# EAGLE design watch (EAGLE 7.5.0)
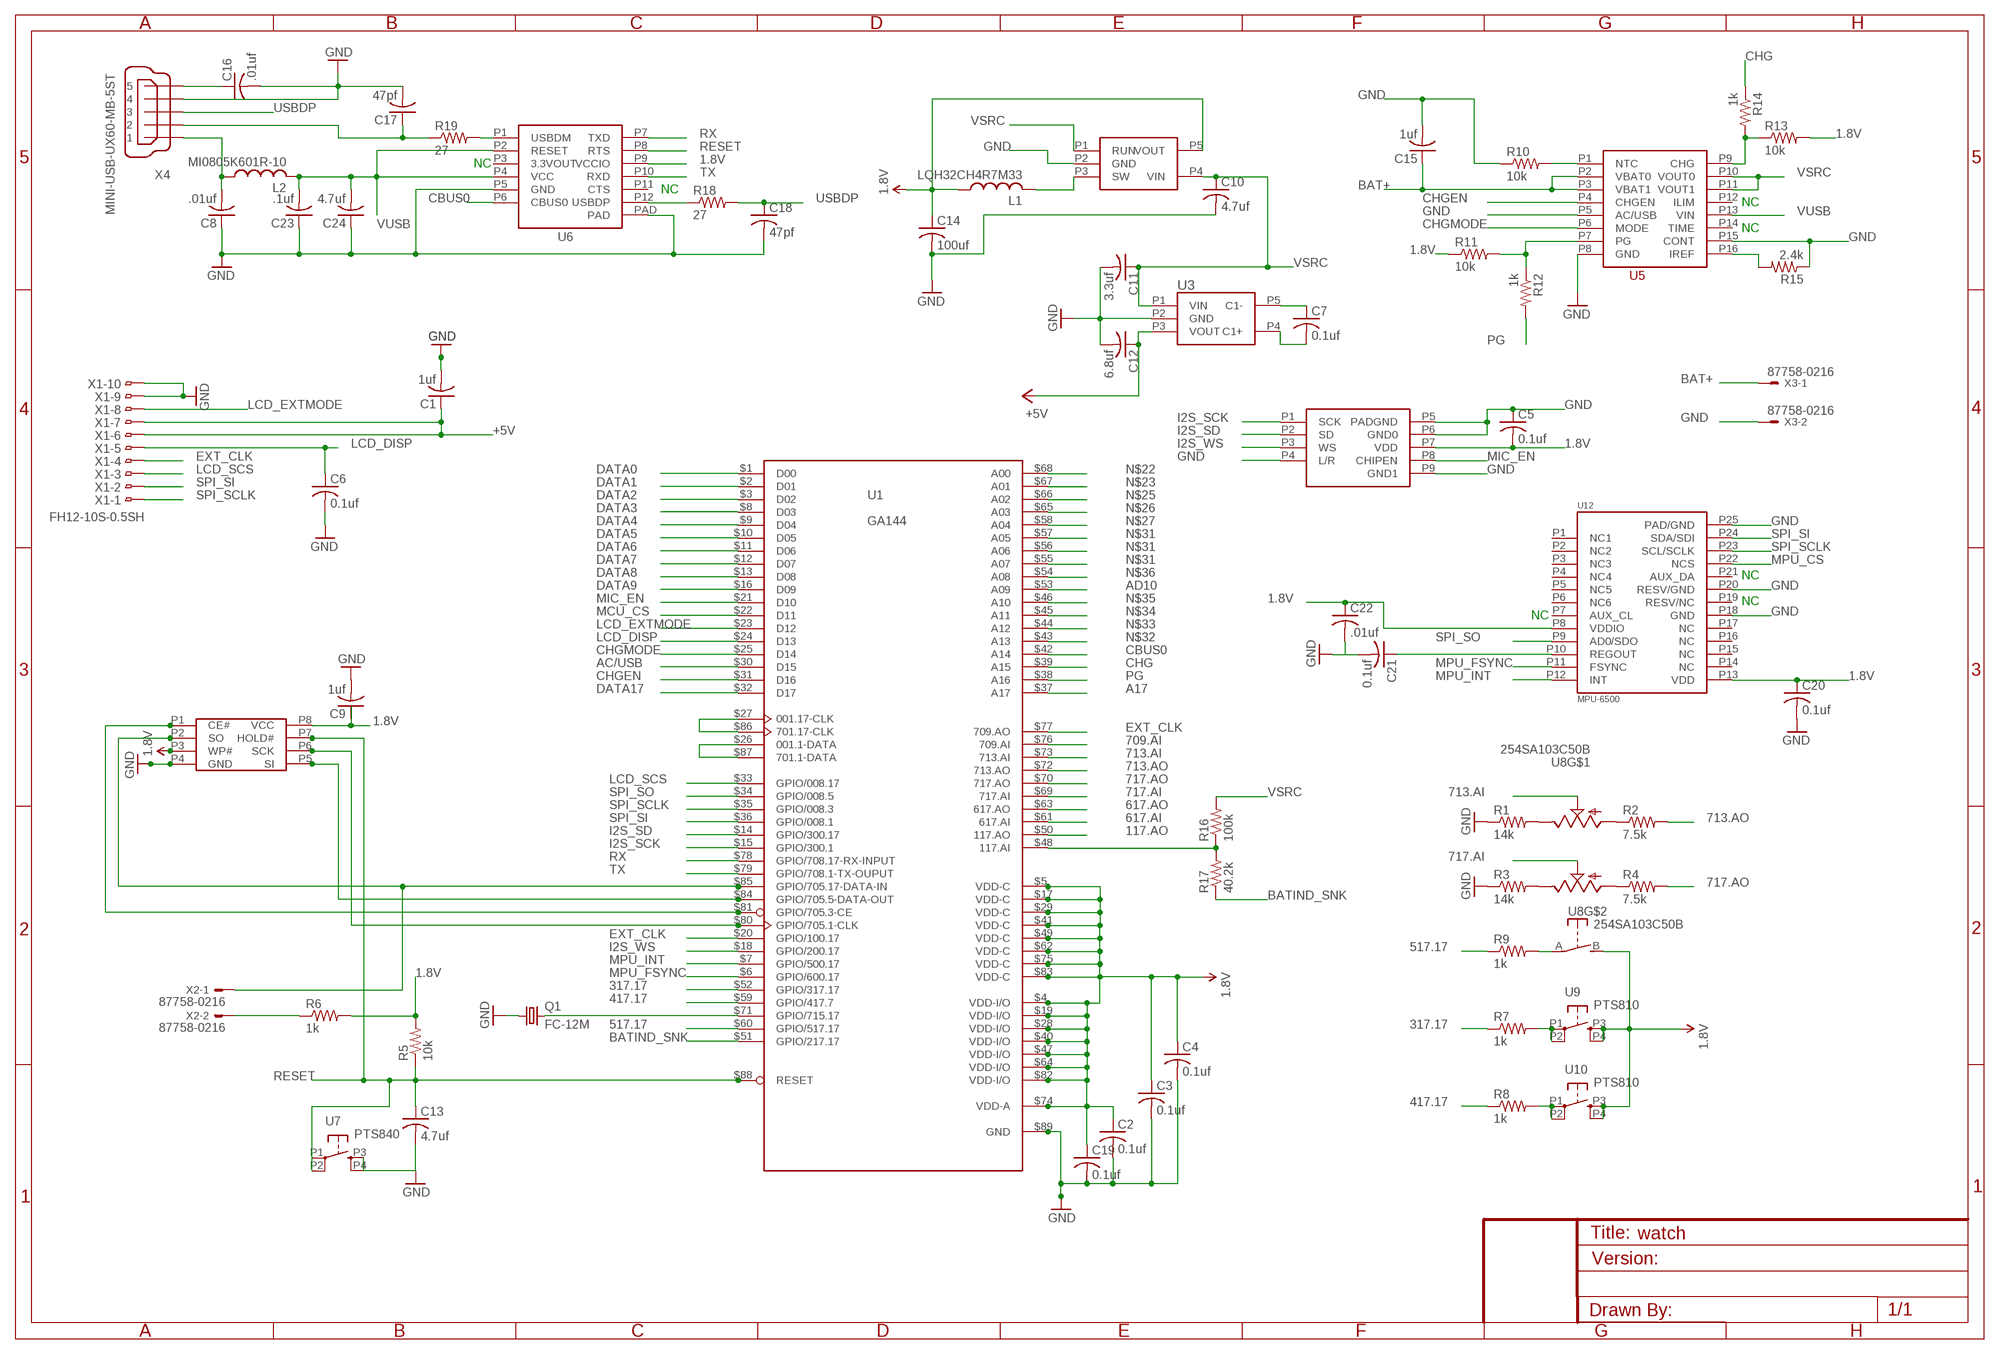
[diagram p0: schematic, sheet 1]

## Parts
C1  1uf  C-USC0402  [C0402]
C2  0.1uf  C-USC0402  [C0402]
C3  0.1uf  C-USC0402  [C0402]
C4  0.1uf  C-USC0402  [C0402]
C5  0.1uf  C-USC0402  [C0402]
C6  0.1uf  C-USC0402  [C0402]
C7  0.1uf  C-USC0402  [C0402]
C8  .01uf  C-USC0402  [C0402]
C9  1uf  C-USC0402  [C0402]
C10  4.7uf  C-USC0603  [C0603]
C11  3.3uf  C-USC0603  [C0603]
C12  6.8uf  C-USC0805  [C0805]
C13  4.7uf  C-USC0603  [C0603]
C14  100uf  C-USC1206  [C1206]
C15  1uf  C-USC0402  [C0402]
C16  .01uf  C-USC0402  [C0402]
C17  47pf  C-USC0402  [C0402]
C18  47pf  C-USC0402  [C0402]
C19  0.1uf  C-USC0402  [C0402]
C20  0.1uf  C-USC0402  [C0402]
C21  0.1uf  C-USC0402  [C0402]
C22  .01uf  C-USC0402  [C0402]
C23  .1uf  C-USC0402  [C0402]
C24  4.7uf  C-USC0402  [C0402]
L1  LQH32CH4R7M33  [1210]
L2  MI0805K601R-10  [C0805]
Q1  FC-12M  [FC-12M]
R1  14k  R-US_R0402  [R0402]
R2  7.5k  R-US_R0402  [R0402]
R3  14k  R-US_R0402  [R0402]
R4  7.5k  R-US_R0402  [R0402]
R5  10k  R-US_R0402  [R0402]
R6  1k  R-US_R0402  [R0402]
R7  1k  R-US_R0402  [R0402]
R8  1k  R-US_R0402  [R0402]
R9  1k  R-US_R0402  [R0402]
R10  10k  R-US_R0402  [R0402]
R11  10k  R-US_R0402  [R0402]
R12  1k  R-US_R0402  [R0402]
R13  10k  R-US_R0402  [R0402]
R14  1k  R-US_R0402  [R0402]
R15  2.4k  R-US_R0402  [R0402]
R16  100k  R-US_R0402  [R0402]
R17  40.2k  R-US_R0402  [R0402]
R18  27  R-US_R0402  [R0402]
R19  27  R-US_R0402  [R0402]
U1  GA144  [QFN88-0.4MM]
U2  LTC3406-1.8  [TSOT23]
U3  LTC1517-5  [TSOT23]
U4  IS25WP128-JKLE  [WSON8]
U5  ISL9230  [16_LD_QFN]
U6  FT234XD  [DFN-12]
U7  PTS840  [PTS840GMPSMTRLFS]
U8  254SA103C50B  [254SA103C50B]
U9  PTS810  [PTS810]
U10  PTS810  [PTS810]
U11  INMP441  [INMP441]
U12  MPU-6500  [QFN24-3]
X1  FH12-10S-0.5SH  [FH12-10S-0.5SH]
X2  87758-0216  [87758-0216]
X3  87758-0216  [87758-0216]
X4  MINI-USB-UX60-MB-5ST  [UX60-MB-5ST]

## Nets
1.8V: C2.1 C3.1 C4.1 C5.2 C9.1 C14.1 C19.1 C20.1 C22.1 L1.P$1 R5.2 R6.2 R11.1 R13.2 U1.$4(VDD-I/O) U1.$5(VDD-C) U1.$17(VDD-C) U1.$19(VDD-I/O) U1.$28(VDD-I/O) U1.$29(VDD-C) U1.$40(VDD-I/O) U1.$41(VDD-C) U1.$47(VDD-I/O) U1.$49(VDD-C) U1.$62(VDD-C) U1.$64(VDD-I/O) U1.$74(VDD-A) U1.$75(VDD-C) U1.$82(VDD-I/O) U1.$83(VDD-C) U2.P5(VOUT) U4.P3(WP#) U4.P8(VCC) U6.P9(VCCIO) U8.B U9.P3(S) U9.P4(S1) U10.P3(S) U10.P4(S1) U11.P7(VDD) U12.P8(VDDIO) U12.P13(VDD)
117.AO: U1.$50(117.AO)
317.17: R7.1 U1.$52(GPIO/317.17)
417.17: R8.1 U1.$59(GPIO/417.7)
517.17: R9.1 U1.$60(GPIO/517.17)
617.AI: U1.$61(617.AI)
617.AO: U1.$63(617.AO)
709.AI: U1.$76(709.AI)
713.AI: U1.$73(713.AI) U8.P2
713.AO: R2.2 U1.$72(713.AO)
717.AI: U1.$69(717.AI) U8.P2'
717.AO: R4.2 U1.$70(717.AO)
+5V: C1.1 C12.1 U3.P3(VOUT) X1.6 X1.7
A17: U1.$37(A17)
AC/USB: U1.$30(D15)
AD10: U1.$53(A09)
BAT+: C15.1 U5.P2(VBAT0) U5.P3(VBAT1) X3.1
BATIND: R16.1 R17.2 U1.$48(117.AI)
BATIND_SNK: R17.1 U1.$51(GPIO/217.17)
CBUS0: U1.$42(A14) U6.P6(CBUS0)
CHG: R14.1 U1.$39(A15)
CHGEN: U1.$31(D16) U5.P4(CHGEN)
CHGMODE: U1.$25(D14) U5.P6(MODE)
DATA0: U1.$1(D00)
DATA1: U1.$2(D01)
DATA2: U1.$3(D02)
DATA3: U1.$8(D03)
DATA4: U1.$9(D04)
DATA5: U1.$10(D05)
DATA6: U1.$11(D06)
DATA7: U1.$12(D07)
DATA8: U1.$13(D08)
DATA9: U1.$16(D09)
DATA17: U1.$32(D17)
EXT_CLK: U1.$20(GPIO/100.17) U1.$77(709.AO) X1.4
GND: C1.2 C2.2 C3.2 C4.2 C5.1 C6.2 C8.1 C9.2 C10.2 C11.2 C12.2 C13.2 C14.2 C15.2 C16.2 C17.2 C18.2 C19.2 C20.2 C21.2 C22.2 C23.1 C24.1 Q1.1 R1.1 R3.1 R10.1 R15.1 U1.$89(GND) U2.P2(GND) U3.P2(GND) U4.P4(GND) U5.P5(AC/USB) U5.P8(GND) U5.P15(CONT) U6.P5(GND) U6.PAD U7.P3(S) U7.P4(S1) U11.P4(L/R) U11.P5(PADGND) U11.P6(GND0) U11.P9(GND1) U12.P18(GND) U12.P20(RESV/GND) U12.P25(PAD/GND) X1.9 X1.10 X3.2 X4.4
I2S_SCK: U1.$15(GPIO/300.1) U11.P1(SCK)
I2S_SD: U1.$14(GPIO/300.17) U11.P2(SD)
I2S_WS: U1.$18(GPIO/200.17) U11.P3(WS)
LCD_DISP: C6.1 U1.$24(D13) X1.5
LCD_EXTMODE: U1.$23(D12) X1.8
LCD_SCS: U1.$33(GPIO/008.17) X1.3
MCU_CS: U1.$22(D11)
MIC_EN: U1.$21(D10) U11.P8(CHIPEN)
MPU_CS: U12.P22(NCS)
MPU_FSYNC: U1.$6(GPIO/600.17) U12.P11(FSYNC)
MPU_INT: U1.$7(GPIO/500.17) U12.P12(INT)
N$1: R6.1 X2.2
N$2: C7.1 U3.P5(C1-)
N$3: C7.2 U3.P4(C1+)
N$4: R10.2 U5.P1(NTC)
N$5: U1.$26(001.1-DATA) U1.$87(701.1-DATA)
N$6: U1.$27(001.17-CLK) U1.$86(701.17-CLK)
N$7: L1.P$2 U2.P3(SW)
N$8: Q1.2 U1.$71(GPIO/715.17)
N$9: U1.$81(GPIO/705.3-CE) U4.P1(CE#)
N$10: U1.$85(GPIO/705.17-DATA-IN) U4.P2(SO) X2.1
N$12: R15.2 U5.P16(IREF)
N$13: C21.1 U12.P10(REGOUT)
N$14: R11.2 R12.1 U5.P7(PG)
N$15: R1.2 U8.P1
N$16: R2.1 U8.P3
N$17: R3.2 U8.P1'
N$18: R4.1 U8.P3'
N$19: R7.2 U9.P1(P) U9.P2(P1)
N$20: R8.2 U10.P1(P) U10.P2(P1)
N$21: R13.1 R14.2 U5.P9(CHG)
N$22: U1.$68(A00)
N$23: U1.$67(A01)
N$24: R9.2 U8.A
N$25: U1.$66(A02)
N$26: U1.$65(A03)
N$27: U1.$58(A04)
N$28: C16.1 X4.5
N$29: U1.$57(A05)
N$30: U1.$56(A06)
N$31: U1.$55(A07)
N$32: U1.$43(A13)
N$33: U1.$44(A12)
N$34: U1.$45(A11)
N$35: U1.$46(A10)
N$36: U1.$54(A08)
N$45: U1.$84(GPIO/705.5-DATA-OUT) U4.P5(SI)
PG: R12.2 U1.$38(A16)
RESET: C13.1 R5.1 U1.$88(RESET) U4.P7(HOLD#) U6.P8(RTS) U7.P1(P) U7.P2(P1)
RX: U1.$78(GPIO/708.17-RX-INPUT) U6.P7(TXD)
SCK: U1.$80(GPIO/705.1-CLK) U4.P6(SCK)
SPI_SCLK: U1.$35(GPIO/008.3) U12.P23(SCL/SCLK) X1.1
SPI_SI: U1.$36(GPIO/008.1) U12.P24(SDA/SDI) X1.2
SPI_SO: U1.$34(GPIO/008.5) U12.P9(AD0/SDO)
TX: U1.$79(GPIO/708.1-TX-OUPUT) U6.P10(RXD)
USBDM: C17.1 R19.1 R19.2 U6.P1(USBDM) X4.2
USBDP: C18.1 R18.1 R18.2 U6.P12(USBDP) X4.3
VSRC: C10.1 C11.1 R16.2 U2.P1(RUN) U2.P4(VIN) U3.P1(VIN) U5.P10(VOUT0) U5.P11(VOUT1)
VUSB: C8.2 C23.2 C24.2 L2.1 L2.2 U5.P13(VIN) U6.P2(RESET) U6.P4(VCC) X4.1
Unconnected: U5.P12(ILIM) U5.P14(TIME) U6.P3(3.3VOUT) U6.P11(CTS) U12.P1(NC1) U12.P2(NC2) U12.P3(NC3) U12.P4(NC4) U12.P5(NC5) U12.P6(NC6) U12.P14(NC) U12.P15(NC) U12.P16(NC) U12.P17(NC)

## Notes on the sheet
- NC
- NC
- NC
- NC
- NC
- NC
- NC

## Power pins joined to a net without a drawn wire
AUX_CL: U12.P7(AUX_CL)
AUX_DA: U12.P21(AUX_DA)
RESV/NC: U12.P19(RESV/NC)

## Library data of the parts
C1-C13 C15-C24 = resistor:C-US: CAPACITOR, American symbol
C14 = ga144:C-US: CAPACITOR, American symbol
L1 = ga144:LQH32CH4R7M33
L2 = ga144:MI0805K601R-10: FERRITE CHIP POWER 600 OHM SMD
Q1 = crystal:FC-12M: kHz RANGE CRYSTAL UNIT LOW PROFILE SMD Source: Epson Toyocom FC-12M.pdf
R1-R19 = resistor:R-US_: RESISTOR, American symbol
U1 = ga144:GA144: Parallel Processing for Embedded Systems The GA144 measures just 1cm x 1cm. It integrates 144 F18A computers in an 18 x 8 array. # Each of its F18A computers can perform a basic ALU function in about 1.5 nanoseconds while only consuming about 7 picojoules. http://greenarraychips.com/ library GA144 eagle : http://esaid.free.fr/
U2 = ga144:LTC3406-1.8
U3 = ga144:LTC1517-5
U4 = ga144:IS25WP128-JKLE: The IS25WP128/064/032 Serial Flash memory offers a versatile storage solution with high flexibility and performance in a simplified pin count package. ISSI’s “Industry Standard Serial Interface” Flash is for systems that require limited space, a low pin count, and low power consumption. The device is accessed through a 4-wire SPI Interface consisting of a Serial Data Input (SI), Serial Data Output (SO), Serial Clock (SCK), and Chip Enable (CE#) pins, which can also be configured to serve as multi-I/O (see pin descriptions).
U5 = ga144:ISL9230
U6 = ga144:FT234XD
U7 = ga144:PTS840: PTS840GMPSMTRLFS
U8 = ga144:254SA103C50B
U9 U10 = ga144:PTS810: PTS840GMPSMTRLFS
U11 = ga144:INMP441
U12 = MPU-60X0:MPU-6500: MPU-6500
X1 = con-hirose:FH12-10S-0.5S: 0.5mm Pitch Connectors For FPC/FFC Source: Data sheet <http://www.hirose.co.jp/cataloge_hp/e58605370.pdf>; MPN: FH12-10S-0.5SH(55); OC_FARNELL: 1324540; OC_NEWARK: 34M6152
X2 X3 = con-molex:87758-0216: 2 Pin - 2mm Dual Row Single Wafer, Vertical T/H HDR Source: http://www.molex.com/pdm_docs/sd/877580616_sd.pdf; MPN: 87758-0216; OC_FARNELL: unknown; OC_NEWARK: 94M1513
X4 = con-hirose:MINI-USB-: MINI USB Connector Source: http://www.hirose.co.jp/cataloge_hp/e24000019.pdf; OC_FARNELL: unknown; OC_NEWARK: unknown

## Board
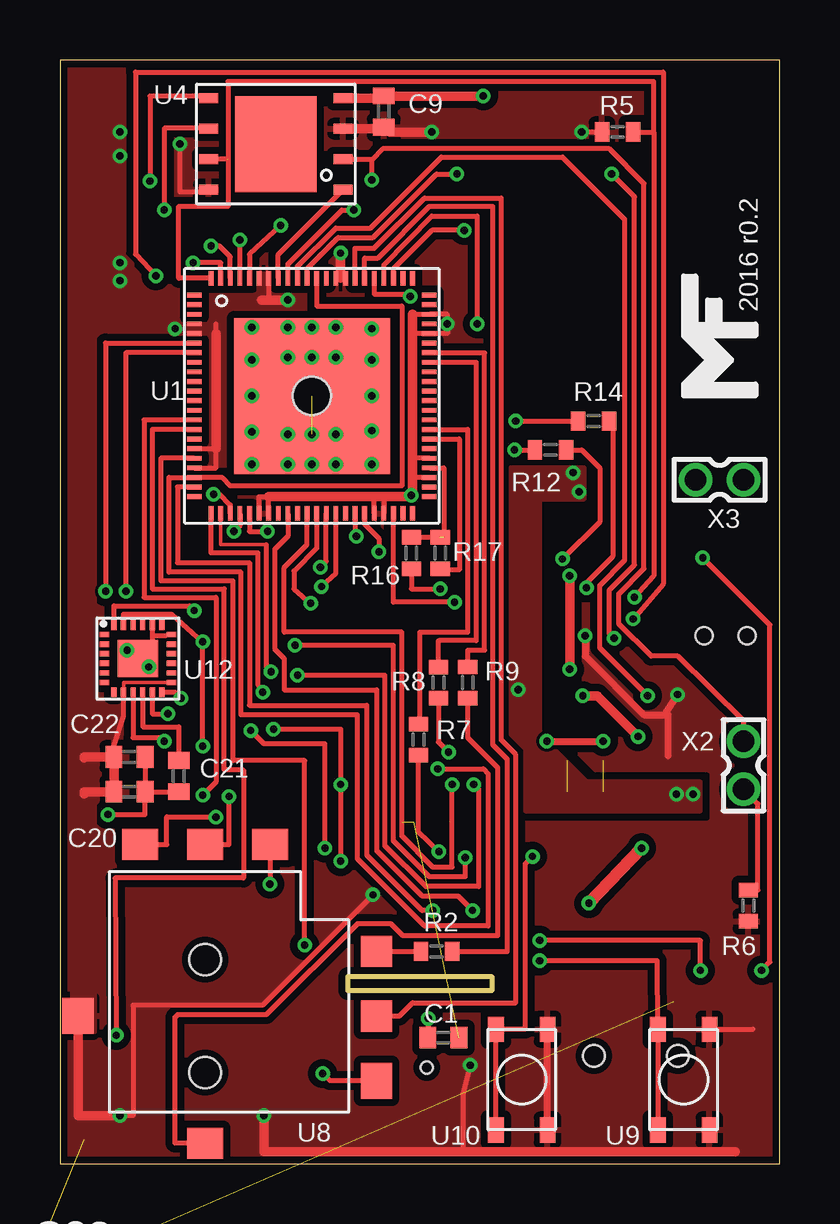
[diagram p1: board, top side]
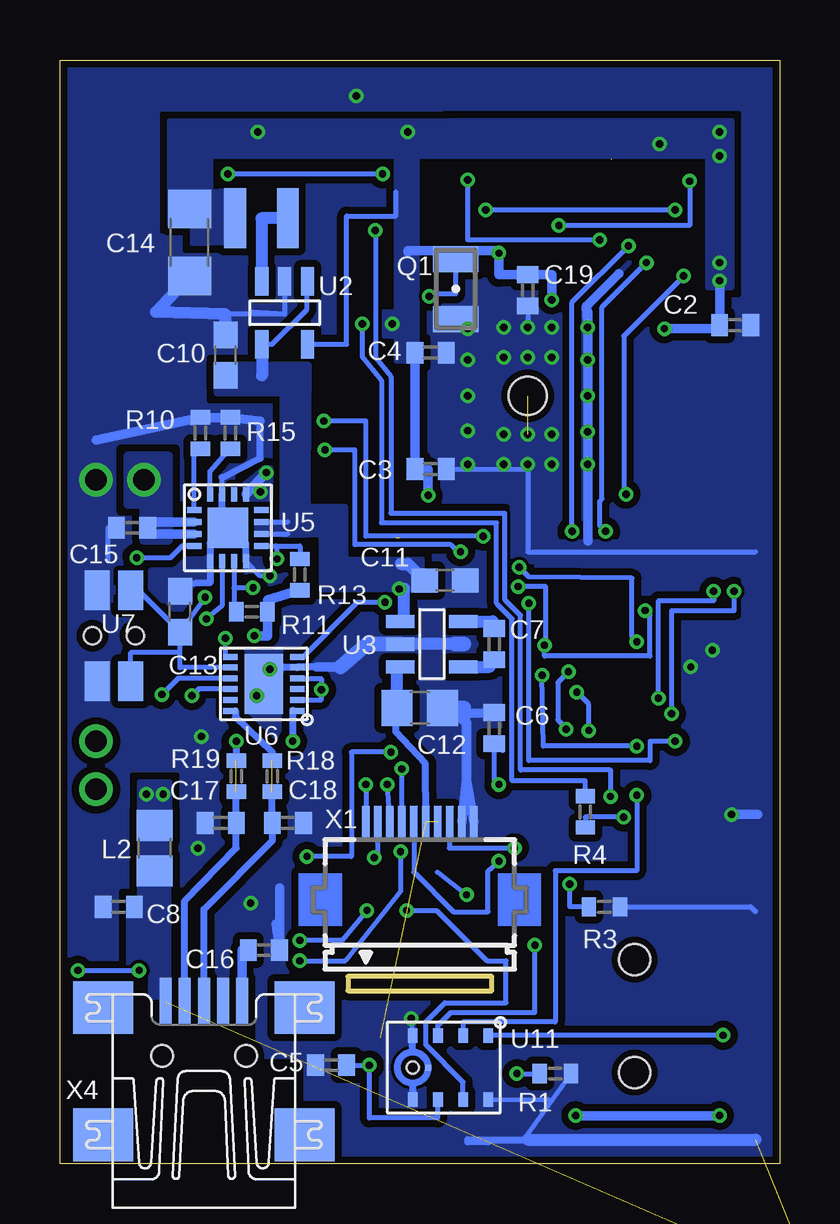
[diagram p2: board, bottom side, seen from below]

Size 30 x 46 mm. Coordinates in mm from the lower left corner, seen from the top.
Outline: 0,0 30,0 30,46 0,46 0,0
Copper layers (1*16): Top 0.035mm / dielectric 1.5mm / Bottom 0.035mm
Design rules "dirt_cheap_dirty_boards.v1": minimum track width 5mil, minimum drill 12mil, track to track 5mil, track to pad 5mil, pad to pad 5mil, via to via 5mil, smd to smd 0mil, copper to edge 10mil, drill to drill 10mil, minimum pad ring 10mil, minimum via ring 6mil, stop-mask expansion 2mil, vias tented up to drill 25mil, thermal gap 10mil
Milling: area 12,7.2 to 18,7.8

### Footprints (pad centres in the part's own frame; a part is rotated, then mirrored left to right if it is on the bottom)
C0402 = smd 0.7 x 0.9: 1 -0.65,0; 2 0.65,0
C0603 = smd 1.1 x 1: 1 -0.85,0; 2 0.85,0
C0805 = smd 1.3 x 1.5: 1 -0.95,0; 2 0.95,0
C1206 = smd 1.6 x 1.8: 1 -1.4,0; 2 1.4,0
1210 = smd 0.9 x 2.5: P$1 -1.1,0; P$2 1.1,0
FC-12M = smd 1.1 x 1.9: 1 -1.25,0; 2 1.25,0
R0402 = smd 0.6 x 0.8: 1 -0.65,0; 2 0.65,0
QFN88-0.4MM = smd 0.6 x 0.2: $1 -4.9,4.2; $2 -4.9,3.8; $3 -4.9,3.4; $4 -4.9,3; $5 -4.9,2.6; $6 -4.9,2.2; $7 -4.9,1.8; $8 -4.9,1.4; $9 -4.9,1; $10 -4.9,0.6; $11 -4.9,0.2; $12 -4.9,-0.2; $13 -4.9,-0.6; $14 -4.9,-1; $15 -4.9,-1.4; $16 -4.9,-1.8; $17 -4.9,-2.2; $18 -4.9,-2.6; $19 -4.9,-3; $20 -4.9,-3.4; $21 -4.9,-3.8; $22 -4.9,-4.2; $45 4.9,-4.2; $46 4.9,-3.8; $47 4.9,-3.4; $48 4.9,-3; $49 4.9,-2.6; $50 4.9,-2.2; $51 4.9,-1.8; $52 4.9,-1.4; $53 4.9,-1; $54 4.9,-0.6; $55 4.9,-0.2; $56 4.9,0.2; $57 4.9,0.6; $58 4.9,1; $59 4.9,1.4; $60 4.9,1.8; $61 4.9,2.2; $62 4.9,2.6; $63 4.9,3; $64 4.9,3.4; $65 4.9,3.8; $66 4.9,4.2 | smd 0.2 x 0.6: $23 -4.2,-4.9; $24 -3.8,-4.9; $25 -3.4,-4.9; $26 -3,-4.9; $27 -2.6,-4.9; $28 -2.2,-4.9; $29 -1.8,-4.9; $30 -1.4,-4.9; $31 -1,-4.9; $32 -0.6,-4.9; $33 -0.2,-4.9; $34 0.2,-4.9; $35 0.6,-4.9; $36 1,-4.9; $37 1.4,-4.9; $38 1.8,-4.9; $39 2.2,-4.9; $40 2.6,-4.9; $41 3,-4.9; $42 3.4,-4.9; $43 3.8,-4.9; $44 4.2,-4.9; $67 4.2,4.9; $68 3.8,4.9; $69 3.4,4.9; $70 3,4.9; $71 2.6,4.9; $72 2.2,4.9; $73 1.8,4.9; $74 1.4,4.9; $75 1,4.9; $76 0.6,4.9; $77 0.2,4.9; $78 -0.2,4.9; $79 -0.6,4.9; $80 -1,4.9; $81 -1.4,4.9; $82 -1.8,4.9; $83 -2.2,4.9; $84 -2.6,4.9; $85 -3,4.9; $86 -3.4,4.9; $87 -3.8,4.9; $88 -4.2,4.9 | smd 6.5 x 6.5: $89 0,0 | hole 1.6: 0,0
TSOT23 = smd 0.55 x 1.2: P1 -0.95,-1.31; P2 0,-1.31; P3 0.95,-1.31; P4 0.95,1.31; P5 -0.95,1.31
WSON8 = smd 0.8 x 0.4: P1 -2.8,1.905; P2 -2.8,0.635; P3 -2.8,-0.635; P4 -2.8,-1.905; P5 2.8,-1.905; P6 2.8,-0.635; P7 2.8,0.635; P8 2.8,1.905 | smd 3.4 x 4: P$1 0,0
16_LD_QFN = smd 0.6 x 0.25: P1 -1.4,0.75; P2 -1.4,0.25; P3 -1.4,-0.25; P4 -1.4,-0.75; P9 1.4,-0.75; P10 1.4,-0.25; P11 1.4,0.25; P12 1.4,0.75 | smd 0.25 x 0.6: P5 -0.75,-1.4; P6 -0.25,-1.4; P7 0.25,-1.4; P8 0.75,-1.4; P13 0.75,1.4; P14 0.25,1.4; P15 -0.25,1.4; P16 -0.75,1.4 | smd 1.7 x 1.7: PAD 0,0
DFN-12 = smd 0.6 x 0.25: P1 -1.4,1.125; P2 -1.4,0.675; P3 -1.4,0.225; P4 -1.4,-0.225; P5 -1.4,-0.675; P6 -1.4,-1.125; P7 1.4,-1.125; P8 1.4,-0.675; P9 1.4,-0.225; P10 1.4,0.225; P11 1.4,0.675; P12 1.4,1.125 | smd 1.6 x 2.5: PAD 0,0
PTS840GMPSMTRLFS = smd 1.65 x 1.05: P1 -1.9,0.7; P2 1.9,0.7; P3 -1.9,-0.7; P4 1.9,-0.7 | hole 0.7: 0,0.9; 0,-0.9
254SA103C50B = smd 1.5 x 1.3: A 0,5.3; P1' -2.7,-7.15; P2' 0,-7.15; P3' 2.7,-7.15 | smd 1.3 x 1.5: B 5.3,0; P1 -7.15,2.7 | smd 1.3 x 1.3: P2 -7.15,0; P3 -7.15,-2.7 | hole 1.3: 0,-2.35; 0,2.35
PTS810 = smd 1.05 x 0.65: P1 -2.1,1.075; P2 2.1,1.075; P3 -2.1,-1.075; P4 2.1,-1.075
INMP441 = smd 0.4 x 0.6: P1 1.86,1.33; P2 0.81,1.33; P3 -0.24,1.33; P4 -1.29,1.33; P6 -1.29,-1.33; P7 -0.24,-1.33; P8 0.81,-1.33; P9 1.86,-1.33 | smd 0.25 x 0.25: P5 -0.65,0 | hole 0.5: -1.29,0
QFN24-3 = smd 0.4 x 0.22: P1 -1.4,1; P2 -1.4,0.6; P3 -1.4,0.2; P4 -1.4,-0.2; P5 -1.4,-0.6; P6 -1.4,-1; P13 1.4,-1; P14 1.4,-0.6; P15 1.4,-0.2; P16 1.4,0.2; P17 1.4,0.6; P18 1.4,1 | smd 0.22 x 0.4: P7 -1,-1.4; P8 -0.6,-1.4; P9 -0.2,-1.4; P10 0.2,-1.4; P11 0.6,-1.4; P12 1,-1.4; P19 1,1.4; P20 0.6,1.4; P21 0.2,1.4; P22 -0.2,1.4; P23 -0.6,1.4; P24 -1,1.4 | smd 1.7 x 1.54: P25 0,0
FH12-10S-0.5SH = smd 0.3 x 1.3: 1 -2.25,3.25; 2 -1.75,3.25; 3 -1.25,3.25; 4 -0.75,3.25; 5 -0.25,3.25; 6 0.25,3.25; 7 0.75,3.25; 8 1.25,3.25; 9 1.75,3.25; 10 2.25,3.25
87758-0216 = drill 0.9 pad 1.27: 1 0,-1; 2 0,1
UX60-MB-5ST = smd 2 x 0.5: 1 2.25,1.6; 2 2.25,0.8; 3 2.25,0; 4 2.25,-0.8; 5 2.25,-1.6 | smd 2.2 x 2.5: M1 -3.3,-4.2; M2 -3.3,4.2; M3 2,4.2; M4 2,-4.2 | hole 0.9: 0,-1.75; 0,1.75

### Placement (x,y rotation side)
C1  15.98,5.25 180 top
C2  1.85,34.95 0 bottom
C3  14.55,28.95 0 bottom
C4  14.55,33.8 0 bottom
C5  18.7,4.1 0 bottom
C6  11.9,18.15 90 bottom
C7  11.9,21.65 270 bottom
C8  27.55,10.7 0 bottom
C9  13.5,43.85 90 top
C10  23.1,33.7 90 bottom
C11  13.95,24.3 0 bottom
C12  15,19 0 bottom
C13  25,23 90 bottom
C14  24.6,38.4 270 bottom
C15  27,26.5 180 bottom
C16  21.5,8.9 0 bottom
C17  23.3,14.2 180 bottom
C18  20.5,14.2 0 bottom
C19  10.5,36.4 270 bottom
C20  2.9,15.5 0 top
C21  4.95,16.15 270 top
C22  2.9,16.95 0 top
C23  -0.5,-4.3 0 top  (outside the outline)
C24  -0.5,-9.1 0 top  (outside the outline)
L1  21.6,39.4 0 bottom
L2  26.05,13.15 90 bottom
Q1  13.5,36.45 90 bottom
R1  9.35,3.75 180 bottom
R2  15.7,8.84 0 top
R3  7.3,10.7 180 bottom
R4  8.1,14.66 90 bottom
R5  23.25,43 180 top
R6  28.7,10.75 270 top
R7  14.95,17.67 270 top
R8  15.78,20.04 270 top
R9  17,20.05 270 top
R10  24.15,30.45 270 bottom
R11  22,23 180 bottom
R12  22.25,30.95 180 top
R13  20,24.55 270 bottom
R14  20.45,29.75 0 top
R15  22.9,30.45 270 bottom
R16  14.65,25.45 270 top
R17  15.85,25.45 90 top
R18  21.15,16.15 270 bottom
R19  22.65,16.15 90 bottom
U1  10.5,32 0 top
U2  20.63,35.46 180 bottom
U3  14.5,21.65 270 bottom
U4  9,42.5 180 top
U5  23,26.5 0 bottom
U6  21.5,20 180 bottom
U7  27.75,22 270 bottom
U8  6.05,6.15 180 top
U9  26,3.5 90 top
U10  19.25,3.5 90 top
U11  14,4 0 bottom
U12  3.25,21.05 0 top
X1  15,11 0 bottom
X2  28.5,16.6 180 top
X3  27.5,28.5 270 top
X4  24,4.5 90 bottom

### Tracks (layer width: path | path; a pad name or v marks a point on that pad's centre or on a via)
1.8V  (via drill 0.3, 0.3 pad 0.25)
  Top 0.14: U12.P8 2.65,20.05 U12.P13
  Top 0.2: R5.2 v21.75,43 | U4.P8 6.11,40.5 5,40.5 v5,42.5 | U1.$82 8.7,36 | U1.$19 6.5,29 6.5,29.8 U1.$17 | 6.5,34.6 6.5,35 | C22.1 2.25,17.45 2.65,18.65 U12.P8 | U1.$28 8.3,27.8 8.7,27.8 U1.$29 | 13.5,27.8 U1.$41 | U1.$40 13.1,27.8 | U1.$47 14.7,28.6 | 14.7,35.4 U1.$64 16.15,35.4 v16.15,35 16.15,34.6 U1.$62 | U1.$49 14.7,29.4 | 14.65,27.8 v14.65,27.85 14.7,27.85 | U1.$62 14.7,34.6 | U1.$62 15.45,34.6 | 25.2,18.7 25.35,18.7 | v13.05,11.2 8.45,6.6 3.05,6.6 3.05,2 v2.5,2 | U9.P4 28.9,5.6 | v17.1,4.1 16.8,2.9 16.8,0.5
  Top 0.3: v21.9,22 21.9,21.15 24.35,18.7 25.2,18.7 v25.75,19.55 | U10.P3 U10.P4 | 25.35,18.7 25.35,17
  Top 0.4: v15.5,43 13.75,43 C9.1 13.38,43.13 U4.P3 | 8.4,36 8.7,36 v9.5,36 | v2.5,2 0.75,2 U8.B | 28.15,0.5 16.8,0.5 8.5,0.5 v8.5,2 | 6.5,29.8 6.5,34.6 | 1,15.4 1,15.5 C20.1 2.25,16.9 | C22.1 1,16.95 1,16.9 | 8.7,27.8 13.1,27.8 13.5,27.8 14.65,27.8 | 14.7,28.6 14.7,29.4 14.7,34.6 14.7,35.4 | 14.7,27.85 14.7,28.5 | 11.7,36.9 v11.7,37.95
  Bottom 0.2: U6.P9 25.07,20.23 v25.75,19.55 | 14.27,12.15 v13.05,11.2 | U11.P7 14.25,2.16 14.25,1.9 17.1,1.9 v17.1,4.1 C5.2 | 2.55,34.8 C2.1 | U2.P5 18.05,34.15 18.05,39.5 16,39.5 16,40.5
  Bottom 0.4: R13.2 21.35,23.5 R11.1 21.35,22 v21.9,22 | v8.5,2 v2.5,2 | v4.8,34.8 2.55,34.8 | C2.1 v2.5,36.8 | 14.65,27.8 v14.65,27.85 14.65,28.95 C3.1 C4.1 | 15.5,38.05 15.5,38 15.45,38.05 11.9,38.05 11.8,37.95 v11.7,37.95 11.7,37.05 C19.1 9.5,37.05 v9.5,36
  other vias: 2.5,37.55 2.5,43 2.5,42
  pour Bottom (no thermals): 25.45,40.5 25.45,39.2 24.5,39.2 24.5,38.35 22.35,38.4 22.35,40.55
  pour Bottom (no thermals): 25.45,39.15 23.7,39.2 23.7,42 2,42 2,43.5 25.45,43.45
  pour Top (no thermals): 8.3,37.1 8.7,37.1 8.7,35.9 8.3,35.9
  pour Bottom: 2,43.5 2,36.5 3,36.5 3,43.5
  pour Top (no thermals): 1.45,36.2 3,36.25 3,37.5 1.5,39 0.5,39 0.5,5.55 1.45,5.5
  pour Bottom (no thermals): 16,42 16,33.45 14.95,33.45 14.95,34.15 15.1,34.15 15.1,42
  pour Top (no thermals): 6.6,34.6 4.65,34.6 4.65,35 6.6,35
  pour Bottom: 16,35.5 16.5,35.5 16.5,34.5 16,34.5
  pour Top (isolate 0.3, rank 4): 0,46 30,46 30,0 0,0
317.17
  Top 0.2: U1.$52 17,30.6 17,22.15 15,22.15 15,18.32 R7.1
417.17
  Top 0.2: U1.$59 17.35,33.4 17.35,21.8 15.8,21.8 15.78,21.78 R8.1
517.17
  Top 0.2: U1.$60 17.7,33.8 17.7,21.4 17,21.4 R9.1
713.AI
  Top 0.2: U1.$73 12.3,38.15 13.1,38.15 15.2,40.25 18.4,40.25 18.4,17.65 19,17.05 19,6.7 14.7,6.7 14.15,6.15 U8.P2
713.AO
  Top 0.2: U1.$72 12.7,37.75 13.25,37.75 15.4,39.9 18.05,39.9 18.05,17.45 18.65,16.85 18.65,8.84 R2.2
717.AI  (via drill 0.3)
  Top 0.2: U1.$69 13.9,37.3 15.5,38.9 v16.85,38.9 | U8.P2' 7.05,13.3 v7.05,15.3
  Bottom 0.2: v16.85,38.9 16.85,33.6 16.2,32.8 16.2,27.1 11.45,27.1 11.45,23.5 10.8,22.85 10.8,16.4 7.05,16.4 v7.05,15.3
717.AO  (via drill 0.3)
  Top 0.2: U1.$70 13.5,37.45 15.5,39.5 17.4,39.5 v17.4,35
  Bottom 0.2: v17.4,35 17.4,33.65 16.6,32.65 16.6,26.7 11.8,26.7 11.8,23.35 11.15,22.7 11.15,15.95 8.1,15.95 R4.2
+5V  (2 unrouted)
  Top 0.2: 16.9,4.98 C1.1
  Bottom 0.3: X1.6 14.77,16.67 16,18 16,18.6
  Bottom 0.4: 16,18.6 C12.1
  Bottom 0.5: C12.1 15.95,20.7 U3.P3
BAT+
  Bottom 0.4: U5.P2 26.35,26.75 C15.1 26.35,26.25 U5.P3
  pour Bottom (no thermals): 25.5,26 25.5,29.5 27.15,29.5 27.15,27.5 26.5,27.5 26.5,26
BATIND  (1 unrouted)
  Top 0.2: U1.$48 16,29 16,26.1 R16.1
BATIND_SNK
  Top 0.2: U1.$51 16.65,30.2 16.65,24.75 15.85,24.75 R17.1 16,24.8 16,25
CBUS0  (via drill 0.3)
  Top 0.2: v16.45,23.4 13.9,23.4 U1.$42
  Bottom 0.2: U6.P6 19.88,21.12 17.6,23.4 v16.45,23.4
CHG  (via drill 0.3)
  Top 0.2: U1.$39 12.7,26.65 13.3,26.05 v13.3,25.5 | v18.95,29.75 R14.1
  Bottom 0.2: v18.95,29.75 17.7,29.75 17.7,25.8 13.7,25.8 13.4,25.5 v13.3,25.5
CHGEN  (via drill 0.3)
  Top 0.2: v26.8,25.25 29.6,22.45 29.6,8.4 v29.25,8.05 | U1.$31 9.5,26.15 8.95,25.6 8.95,21.45 9.35,21.05 9.35,19.75 13.2,19.75 13.2,13.05 15.1,11.15 16.6,11.15 v17.2,10.55 | v26.7,8.05 26.7,9.3 v20,9.3
  Bottom 0.2: U5.P4 24.9,25.75 25.4,25.25 v26.8,25.25 | v29.25,8.05 v26.7,8.05 | v17.2,10.55 18.25,9.3 v20,9.3
CHGMODE  (via drill 0.3, 0.3 pad 0.25)
  Top 0.2: v23.9,22.7 25.15,24.15 25.15,45.5 3.15,45.5 3.15,37.9 v4,37 | v6.4,27.9 6.65,27.9 7.1,27.45 U1.$25
  Bottom 0.2: U5.P6 23.25,23.25 v23.9,22.7 | v4,37 6.5,34.5 6.5,28 v6.4,27.9
EXT_CLK  (via drill 0.3)
  Top 0.2: U1.$77 10.7,35.75 14.25,35.75 14.25,28.25 7.1,28.25 6.75,28.6 U1.$20 4.55,28.6 4.55,24.65 7.55,24.65 7.55,18.7 12.4,18.7 12.4,12.7 15.2,9.9 17.85,9.9 17.85,16.25 17.65,16.45 v15.75,16.45
  Bottom 0.2: X1.4 v15.75,16.45
GND  (via drill 0.3, 0.3 pad 0.25)  (3 unrouted)
  Top 0.2: C22.2 C20.2 | C20.2 C21.2 | U12.P25 3.25,20.6 3.85,21.2 3.85,21.9 | v2,14.55 3.55,14.55 C20.2 | v15.35,6.05 C1.2 | 10.5,35.15 v10.5,34.85 v10.5,33.6 | v9.5,34.85 v8,34.85 | U12.P25 3.25,20.85 2.9,20.5 | v2.8,21.4 2.9,21.4 U12.P25 | 3.25,21.65 U12.P25 | U12.P20 3.85,21.9 | U12.P18 4.5,22.05 4.4,22 3.95,22 3.85,21.9
  Top 0.4: U4.P4 13.36,44.41 C9.2 v17.65,44.5 | v21.25,20.6 v21.25,24.5 | v21.8,19.5 22.4,19.5 v24.1,17.8
  Top 0.5: v22.05,10.85 v24.25,13.15
  Bottom 0.1: 14.65,4.1 15.3,4.75
  Bottom 0.152: U11.P5 14.65,4.1 | U11.P6 15.3,3.28
  Bottom 0.2: U2.P2 20.63,35.4 | 20.63,35.4 22,35.5 | 20.63,35.4 23.1,35.4 | U5.P15 23.25,28.6 | 28,25.1 28,26.5 C15.2 | 25,24 C13.2 | 21.5,20.68 v21.25,20.6 | U11.P9 9.64,2.66 | v21.25,24.5 21.65,24.5 U5.P8 | 20.8,11.55 20.85,11.5 | U11.P4 15.32,5.83 v15.35,6.05 | R3.1 1.2,10.7 1,10.5 | R1.1 10.6,1.1 10.5,1 | C19.2 v10.5,34.85 10.5,34.7 | C3.2 10.5,28.95 10.5,25.5 1,25.5 | 13.15,24.2 C11.2
  Bottom 0.3: 23.25,28.6 21.65,29.4 21.65,30.95 | 21.5,20.68 U6.P5 20.07,20.7 19.3,20.7 | 12.15,0.9 13,0.9 13,1 10.5,1 | U5.P8 22.25,25.85 23.25,25.85 | 23.25,25.85 U5.P15 | 23.25,25.85 23.75,25.85 23.75,24.2 25,24.15 25,24 | 15.3,4.75 15.3,5.3 | 15.3,3.28 15.3,2.5
  Bottom 0.4: R10.1 28.5,30.15 | R10.1 R15.1 21.65,30.95 | 24.5,30.95 R10.1 | 21,10 C16.2 20.85,11.5 | X1.9 13.05,15.99 | X1.10 13.05,15.99 | 13.05,15.99 13.05,18.4 C12.2 13.35,18.75 C6.2 | 18.3,20.7 19.3,20.7 | 8,35.5 v8,34.85 | v8,34.85 v8,32 v8,29.15 8,25.95 | v21.25,20.6 21.35,20.5 | v2,14.55 0.9,14.55 | v8,34.85 8.05,35.75 6.7,37.1
  Bottom 0.5: C14.2 26,35.5 23.1,35.4 C10.2 | 13.5,21.65 13.55,21.65 U3.P2 | 10.5,1 1,1
  Bottom 0.6: U3.P2 17.2,21.65 18.3,20.7 | C12.2 13.15,19 | 13.15,21.65 13.55,21.65 | 21.5,20.68 21.35,20.68
  other vias: 11.5,29.15 8,33.5 9.5,33.6 8,30.5 9.5,30.4 9.5,29.15 10.5,30.4 11.5,34.85 13,34.8 11.5,33.6 13,33.5 13,32 10.5,29.15 11.5,30.4 13,29.15 13,30.55 3.7,20.7
  pour Bottom: 27.85,23.6 29.5,23.6 29.5,45.5 27.85,45.5
  pour Bottom: 27.75,37.95 27.75,34.15 24.05,34.15 24.05,36.5 25.1,36.5 25.1,37.95
  pour Bottom (isolate 0.2, no thermals): 29.2,23.5 24.55,23.45 24.55,24.65 27.45,24.7 27.45,25.1 27.5,25.1 27.5,26.85 28.9,26.85 28.9,24.65 29.2,24.65
  pour Bottom (no thermals): 29.5,45.5 0.5,45.5 0.5,0.5 1.5,0.5 1.5,44 29.5,44
  pour Bottom: 4,21.7 0.4,21.7 0.4,20.4 4,20.4
  pour Bottom (no thermals): 1.5,25.9 10.2,25.9 10.2,28.5 11.15,28.5 11.15,25.1 1.5,25.1
  pour Bottom (isolate 0.3, rank 3, no thermals): 0,46 30,46 30,0 0,0
  pour Bottom (no thermals): 14.8,2.4 14.8,3.4 15.6,3.4 15.9,3.7 15.9,4.3 15.6,4.6 15.3,4.6 15.3,5.6 16.4,5.6 16.4,2.4
I2S_SCK  (via drill 0.3)
  Top 0.2: U1.$15 3.85,30.6 3.85,23.95 6.85,23.95 6.85,16.4 7.65,16.4 7.65,11.9 2.3,11.9 v2.35,5.35
  Bottom 0.2: v2.35,5.35 12.14,5.35 U11.P1
I2S_SD  (via drill 0.3)
  Top 0.2: U1.$14 3.5,31 3.5,23.6 6.5,23.6 6.5,15.9 v5.95,15.35
  Bottom 0.2: U11.P2 13.19,5.9 9.35,5.9 9.35,12.2 5.95,12.2 v5.95,15.35
I2S_WS  (via drill 0.3)
  Top 0.2: U1.$18 4.2,29.4 4.2,24.3 7.2,24.3 7.2,16.8 10.2,16.8 v10.2,9.1
  Bottom 0.2: U11.P3 14.24,5.76 13.7,6.3 10.2,6.3 v10.2,9.1
LCD_DISP  (via drill 0.3)
  Top 0.152: 8.6,25.8 6.7,25.8 U1.$24
  Top 0.2: v8.9,18.1 11.7,18.1 v11.7,15.8 v11.7,12.6 | 8.6,25.8 8.6,20.7 v8.8,20.5
  Bottom 0.2: 11.55,17.2 C6.1 | C6.1 12,17.5 | 9.05,18.3 v8.9,18.1 8.9,18.15 9.25,18.5 9.25,20.05 v8.8,20.5 | X1.5 15.25,12.15 13.6,10.5 12.15,10.5 12.15,12.2 v11.7,12.6 | C6.1 11.9,16 v11.7,15.8
LCD_EXTMODE  (via drill 0.3)
  Top 0.2: v7.95,18.05 8.5,17.5 11.05,17.5 v11.05,13.15 | v8.45,19.65 8.25,19.95 8.25,25.45 6.3,25.45 U1.$23
  Bottom 0.2: X1.8 13.77,13.15 v11.05,13.15 | v7.95,18.05 7.95,19.15 v8.45,19.65
LCD_SCS  (via drill 0.3)  (1 unrouted)
  Top 0.2: U1.$33 10.3,25.8 9.35,24.85 9.35,22.15 14.25,22.15 14.25,13.65 15.55,12.35 16.35,12.35 v16.35,15.8
  Bottom 0.2: X1.3 v16.35,15.8
MIC_EN  (via drill 0.3)
  Top 0.2: U1.$21 4.9,28.2 4.9,25.05 7.9,25.05 7.9,19.1 12.8,19.1 12.8,12.85 15.1,10.55 v15.55,10.55
  Bottom 0.2: U11.P8 13.19,3.39 14.75,4.95 14.75,5.9 13.95,6.7 11.4,6.7 11.4,8.45 12.2,8.45 14.3,10.55 v15.55,10.55
MPU_FSYNC  (via drill 0.3)
  Top 0.2: U12.P11 3.85,18.75 v4.5,18.75 | U1.$6 1.9,34.2 v1.9,23.85
  Bottom 0.2: v4.5,18.75 4.5,23.05 1.9,23.05 v1.9,23.85
MPU_INT  (via drill 0.3)
  Top 0.2: U1.$7 2.75,33.8 v2.75,23.85 | U12.P12 4.8,19.65 v5.05,19.4
  Bottom 0.2: v5.05,19.4 5.05,23.45 2.75,23.45 v2.75,23.85
N$1
  Top 0.2: R6.1 29.1,11.4 29.1,15 X2.2
N$2
  Bottom 0.5: U3.P5 11.95,22.6 C7.1
N$3
  Bottom 0.4: 12.09,20.7 C7.2
  Bottom 0.5: U3.P4 12.09,20.7
N$4
  Bottom 0.2: U5.P1 24.4,29.8 R10.2
N$5  (via drill 0.3)
  Top 0.2: U1.$87 6.7,37.55 v5.55,37.55 | U1.$26 7.5,26.6 v7.25,26.35
  Bottom 0.2: v5.55,37.55 7.4,35.7 7.4,27.7 7.5,27.6 7.5,26.6 v7.25,26.35
N$6  (via drill 0.3)
  Top 0.2: U1.$27 7.9,26.35 v8.65,26.35 | U1.$86 7.1,37.8 6.65,38.25 v6.3,38.25
  Bottom 0.2: v8.65,26.35 8.65,35.9 v6.3,38.25
N$7
  Bottom 0.5: L1.P$2 21.6,39.4 21.6,36.77 U2.P3
N$8  (via drill 0.3)
  Top 0.2: U1.$71 13.1,36.25 14.5,36.25 v14.6,36.15
  Bottom 0.2: Q1.2 13.5,36.25 14.5,36.25 v14.6,36.15
N$9
  Top 0.2: U1.$81 9.1,37.9 U4.P1
N$10  (via drill 0.3)
  Top 0.2: U1.$85 v7.5,38.5 | v13,41 13,41.85 | 13,41.85 11.8,41.85 U4.P2 | X2.1 28.5,18.45 25.75,21.15 24.65,21.15 23.3,22.5 23.3,23.75 24.35,24.8 24.35,40.85 22.9,42.3 13.45,42.3 13,41.85
  Bottom 0.2: v7.5,38.5 13,38.5 v13,41
N$12
  Bottom 0.2: U5.P16 23.75,28.85 R15.2
N$13
  Top 0.2: U12.P10 3.45,18.2 4.95,18.2 C21.1
N$14  (via drill 0.3 pad 0.25)
  Top 0.2: R12.1 23.05,30.95 23.05,25.3 21.95,24.2 v21.95,24
  Bottom 0.2: U5.P7 22.75,24 | 22.75,24 22.75,23 R11.2 | v21.95,24 22.75,24
N$15  (via drill 0.3)
  Top 0.2: U8.P1 11.25,3.45 v10.95,3.75
  Bottom 0.2: v10.95,3.75 R1.2
N$16
  Top 0.2: U8.P3 15.09,8.85 R2.1
N$17  (via drill 0.3)
  Top 0.2: U8.P1' v8.75,11.65
  Bottom 0.2: R3.2 8.75,10.7 v8.75,11.65
N$18  (via drill 0.3)
  Top 0.2: v6.5,14.44 v6.5,14.45 4.45,14.45 4.45,13.3 U8.P3'
  Bottom 0.2: v6.5,14.44 8.1,14.44 R4.1
N$19  (via drill 0.3)
  Top 0.2: v20,8.45 24.9,8.45 U9.P2 U9.P1 | v15.8,13 14.95,13.8 R7.2
  Bottom 0.2: v20,8.45 18.1,8.45 15.8,11.35 v15.8,13
N$20  (via drill 0.3)
  Top 0.2: R8.2 15.78,17.57 v16.2,17.15 | U10.P1 U10.P2 19.4,5.6 19.4,12.5 v19.7,12.8
  Bottom 0.2: v16.2,17.15 17.85,17.15 17.85,12.8 v19.7,12.8
N$21  (via drill 0.3)
  Top 0.2: R14.2 21.75,29.75 22.5,29 22.5,26.75 v20.95,25.2
  Bottom 0.2: U5.P9 21,25.75 | 21,25.75 20,25.75 R13.1 | v20.95,25.2 20.95,25.7 21,25.75
N$24
  Top 0.2: U8.A 4.8,0.85 4.8,6.1 4.9,6.2 8.6,6.2 12.4,10 13.8,10 14.3,9.5 18.25,9.5 18.25,16.5 17,17.75 R9.2
N$28
  Bottom 0.4: X4.5 22.4,8.9 C16.1
N$45  (via drill 0.3)
  Top 0.2: U4.P5 6.11,44.5 3.75,44.5 v3.75,40.95 | v9.2,39.1 7.9,37.9 U1.$84
  Bottom 0.2: v3.75,40.95 3.75,39.1 v9.2,39.1
PG  (via drill 0.3)
  Top 0.2: v19,30.95 R12.2 | U1.$38 12.3,26.2 v12.35,26.15
  Bottom 0.2: v19,30.95 17.25,30.95 17.25,26.15 v12.35,26.15
RESET  (via drill 0.3)  (1 unrouted)
  Top 0.2: v23.95,23.6 24.75,24.5 24.75,43 | U4.P7 7.01,41.87 7.01,41.88 7,41.9 7,45.1 24.75,45.1 24.75,43 | 7,41.85 7,39.9 4.95,39.9 4.95,36.9 U1.$88 | R5.1 24.75,43
  Bottom 0.2: U6.P8 25,20.68 25,21.3 | 25,21.3 C13.1 | v23.95,23.6 C13.1 | 24.7,21.8 C13.1 | 25,21.3 27.05,21.3 U7.P2 | U7.P1 26.75,23.9 C13.1
RX  (via drill 0.3)
  Top 0.2: U1.$78 10.3,37.3 11.6,38.6 13.05,38.6 15.7,41.25 v16.55,41.25 | v23.1,21.9 22.9,22.1 22.9,23.9 23.95,24.95 23.95,40.3 v23,41.25
  Bottom 0.2: U6.P7 23.1,21.12 v23.1,21.9 | v16.55,41.25 v23,41.25
SCK  (via drill 0.3)
  Top 0.2: U4.P6 6.18,43.15 4.35,43.15 v4.35,39.75 | U1.$80 9.5,37.5 11.75,39.75 v12.25,39.75
  Bottom 0.2: v4.35,39.75 v12.25,39.75
SPI_SCLK  (via drill 0.3)
  Top 0.2: U12.P23 2.65,22.9 4.65,22.9 v5.95,21.75 v5.95,17.4 | v10.85,24.85 11.1,25.1 U1.$35 | v9.9,20.35 13.55,20.35 13.55,13.25 15.25,11.55 17.45,11.55 17.45,15.6 v17.25,15.8
  Bottom 0.2: v5.95,17.4 9.85,17.4 v9.9,20.35 | v5.95,21.75 6.15,21.95 6.15,24.4 10.45,24.45 v10.85,24.85 | v17.25,15.8 X1.1
SPI_SI  (via drill 0.3)
  Top 0.2: U12.P24 2.25,23.25 5.4,23.25 v5.6,23.05 | U1.$36 11.5,24.6 v10.9,24.05 | v9.8,21.6 13.9,21.6 13.9,13.45 15.4,11.95 16.9,11.95 v16.9,12.75
  Bottom 0.2: v10.9,24.05 9.75,24.05 9.75,21.6 v9.8,21.6 9.8,21.15 5.4,21.15 5.4,22.85 v5.6,23.05 | v16.9,12.75 16.75,12.9 X1.2
SPI_SO  (via drill 0.3)
  Top 0.2: U12.P9 3.05,17.75 4.2,17.75 v4.35,17.6 | U1.$34 10.7,25.65 9.75,24.7 9.75,23.95 v10.45,23.35
  Bottom 0.2: v10.45,23.35 10.45,16.8 5.4,16.8 5.4,17.6 v4.35,17.6
TX  (via drill 0.3)
  Top 0.2: U1.$79 9.9,37.4 11.5,39 12.95,39 15.9,41.95 20.95,41.95 23.55,39.35 23.55,25.15 22.5,24.1 22.5,21.5 v24.5,19.5
  Bottom 0.2: U6.P10 24.25,19.77 24.25,19.75 v24.5,19.5
USBDM  (via drill 0.3)  (1 unrouted)
  Top 0.3: v20.3,17.6 v22.65,17.6
  Bottom 0.2: U6.P1 20.27,18.88 20.3,18.9
  Bottom 0.3: v22.65,17.6 R19.2 | 20.3,18.9 v20.3,17.6 | X4.2 24.8,10.95 22.65,13.15 C17.1 R19.1
USBDP  (1 unrouted)
  Bottom 0.2: U6.P12 22.68,18.88
  Bottom 0.3: X4.3 24,10.6 21.15,13.45 C18.1 R18.2 | R18.1 21.15,17.15 22.68,18.61 22.68,18.88
VSRC  (via drill 0.3)
  Top 0.2: R16.2 14.65,23.95 v15.85,23.95
  Bottom 0.2: U5.P11 20.5,26.75 | U5.P10 20.5,26.25 | U2.P4 21.15,34.15 19.7,35.6 19.7,36.75 U2.P1 | U3.P1 15.65,22.6 | 15.65,23.95 v15.85,23.95
  Bottom 0.5: U2.P4 21.58,32.85 | 15.8,25 15.5,25 C11.1 | 15.65,22.6 15.65,23.95
  pour Bottom: 20.75,33.3 20.75,26.2 19.65,26.2 19.6,33.3
  pour Bottom (no thermals): 20,33.3 23.5,33.3 23.5,32.1 20,32.1
  pour Bottom (no thermals): 14.9,23.9 19.1,23.9 19.1,26.2 20.75,26.2 20.75,27.4 18.1,27.4 18.1,25.2 14.9,25.2
  pour Bottom (no thermals): 20.8,26.75 21.8,26.75 21.8,26.25 20.8,26.25
VUSB  (via drill 0.3 pad 0.25)  (2 unrouted)
  Bottom 0.2: U6.P4 20.07,20.2 19.1,20.2 v19.1,19.75 19.1,19.32 U6.P2
  Bottom 0.4: U5.P13 v21.4,28.8
  other vias: 21.65,28 26.4,15.4 25.7,15.4
  pour Bottom (no thermals): 22.3,27.7 21.2,27.7 21.2,29 21.5,29 22.3,28.35
  pour Bottom (no thermals): 26.7,15.9 26.7,14.3 25.4,14.3 25.4,15.9
  pour Bottom (no thermals): 25.45,13.5 26.7,13.5 26.7,11.05 27.15,11.05 27.15,8.2 26.25,8.2 26.25,6.95 25.45,6.95
  pour Top: 18.8,29 21.85,29 21.85,27.7 20,27.7
  pour Top: 19.4,14.7 26.7,14.7 26.7,15.9 21.95,15.9 20,17.85 20,27.7 21.85,27.7 21.85,29 18.8,29 18.8,17.9 19.4,17.3

### Text on the board
tNames: 2016 r0.2